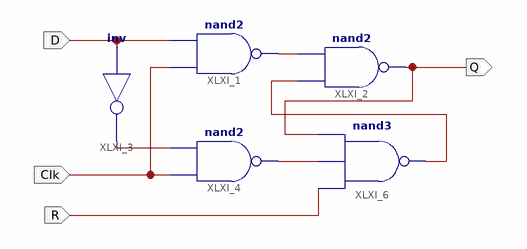
[diagram p0: schematic sheet 1]
// Xilinx ISE schematic D_flip_flop.sch (virtex6) as structural Verilog: 5 symbols, 4 ports
module D_flip_flop (
  input  D,
  input  Clk,
  input  R,
  output Q
);

  wire not_Q, XLXN_2, XLXN_5, XLXN_6;

  nand XLXI_1 (XLXN_6, Clk, D);
  nand XLXI_2 (Q, not_Q, XLXN_6);
  not XLXI_3 (XLXN_2, D);
  nand XLXI_4 (XLXN_5, Clk, XLXN_2);
  nand XLXI_6 (not_Q, R, XLXN_5, Q);
endmodule
